# Altium schematic sheet powerSupply.SchDoc
size A4
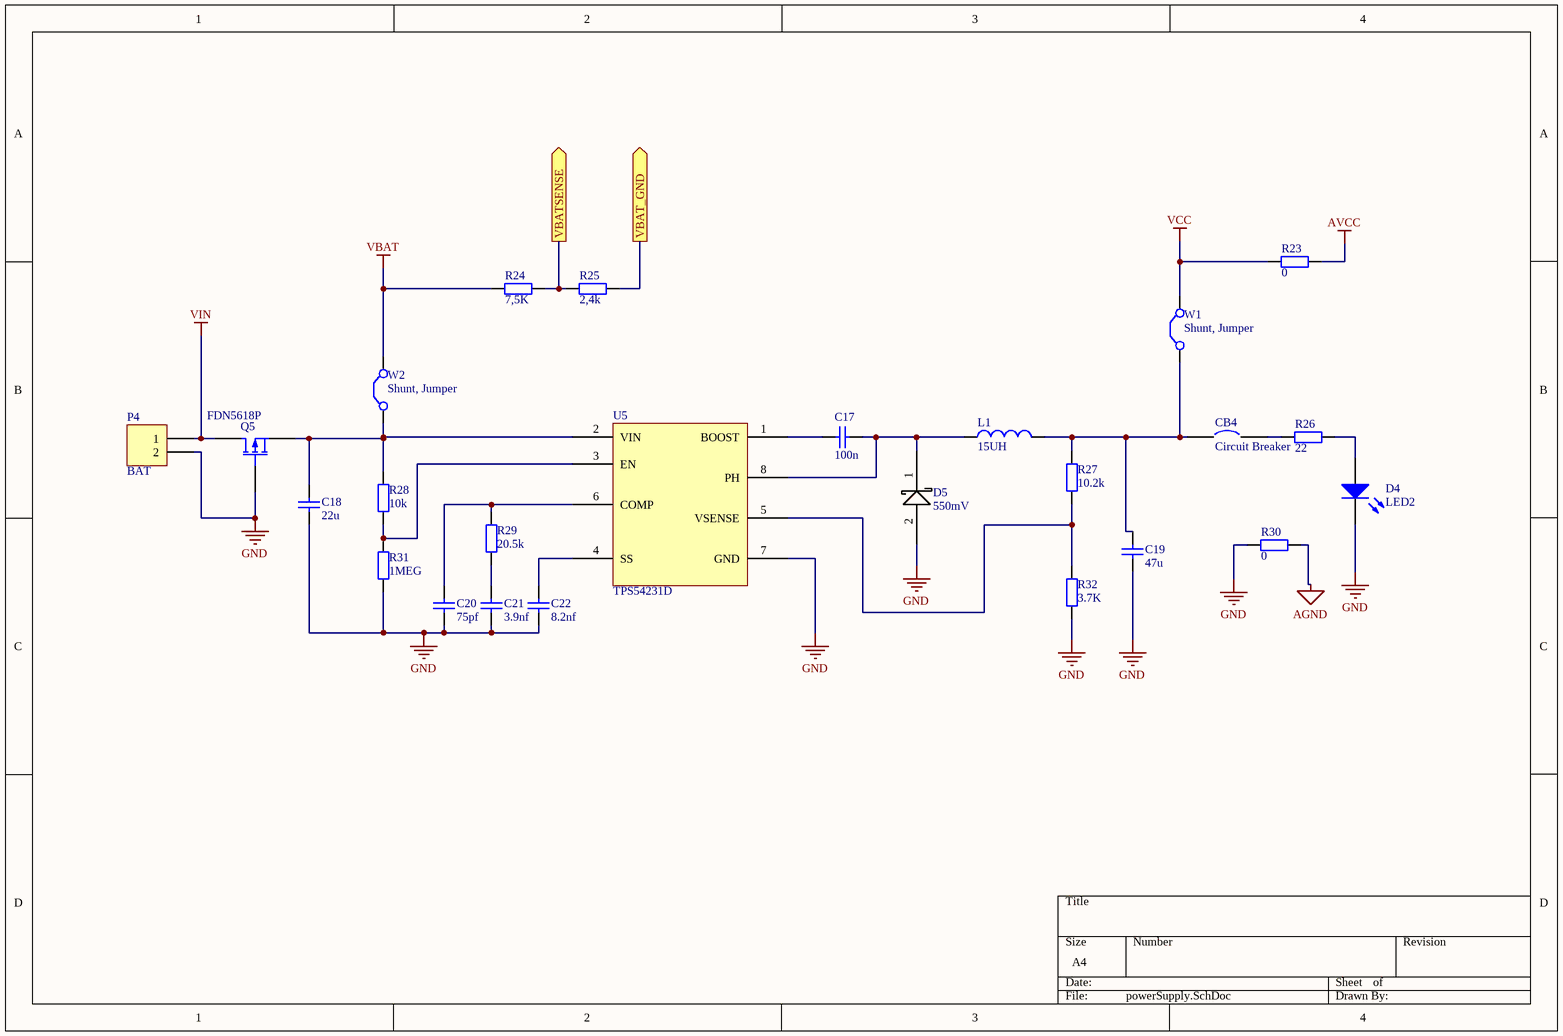
[diagram p0: powerSupply.SchDoc]

## Parts
C17  100n  [CAP 0603/1608]
C18  22u  [CAP 0603/1608]
C19  47u  [CAP 1210/3225 - 2.5MM]
C20  75pf  [CAP 0603/1608]
C21  3.9nf  [CAP 0603/1608]
C22  8.2nf  [CAP 0603/1608]
CB4  Circuit Breaker  [JUMPER PAD]
D4  LED2  [LED 0603/1608 BLUE]
D5  550mV  [microSMA]
L1  15UH  [SRN6045-3R3Y]
P4  BAT  [HDR1X2]
Q5  FDN5618P  [SOT-23_M]
R23  0  [RES 0603/1608]
R24  7,5K  [RES 0603/1608]
R25  2,4k  [RES 0603/1608]
R26  22  [RES 0603/1608]
R27  10.2k  [RES 0603/1608]
R28  10k  [RES 0603/1608]
R29  20.5k  [RES 0603/1608]
R30  0  [RES 0603/1608]
R31  1MEG  [RES 0603/1608]
R32  3.7K  [RES 0603/1608]
U5  TPS54231D  [SOIC8]
W1  Shunt, Jumper  [HDR1X2]
W2  Shunt, Jumper  [HDR1X2]

## Ports
VBAT_GND (out), VBATSENSE (out)

## Nets
AGND: R30.2
AVCC: R23.2
GND: C18.2 C19.2 C20.2 C21.2 C22.2 D4.2(K) D5.2 P4.2 Q5.2(G) R30.1 R31.1 R32.1 U5.7(GND)
VBAT: R24.2 W2.2(C2)
VCC: R23.1 W1.2(C2)
VIN: P4.1 Q5.1(D)
VBAT_GND: R25.1 ; port VBAT_GND
VBATSENSE: R24.1 R25.2 ; port VBATSENSE
NetC17_1: C17.1 U5.1(BOOST)
NetC17_2: C17.2 D5.1 L1.1 U5.8(PH)
NetC18_1: C18.1 Q5.3(S) R28.2 U5.2(VIN) W2.1(C1)
NetC19_1: C19.1 CB4.1 L1.2 R27.2 W1.1(C1)
NetC20_1: C20.1 R29.2 U5.6(COMP)
NetC21_1: C21.1 R29.1
NetC22_1: C22.1 U5.4(SS)
NetCB4_2: CB4.2 R26.1
NetD4_1: D4.1(A) R26.2
NetR27_1: R27.1 R32.2 U5.5(VSENSE)
NetR28_1: R28.1 R31.2 U5.3(EN)

## Library data of the parts
C17 = Cap: AVX  08053C104KAT2A  Condensateur céramique multicouche CMS, 0805 [2012 Metric], 0.1 µF, 25 V, ± 10%, X7R; Fournisseur: Farnell; RefFournisseur: 1740665; Fabricant: AVX; Footprint: 0603; RefFabricant: 08053C104KAT2A; Value: 100n
C18 C20-C22 = Cap: Fabricant: MURATA; Fournisseur: Farnell; Footprint: 0603
  C18: Value: 22u
  C20: Value: 75pf
  C21: Value: 3.9nf
  C22: Value: 8.2nf
C19 = Cap: Condensateur céramique multicouche CMS, 1210 [3225 Metric], 47 µF, 16 V, ± 20%, X5R, Série GRM; Fabricant: KEMET; Fournisseur: Farnell; RefFournisseur: 1572639; RefFabricant: C1206C476M8PACTU; Footprint: 1210; Value: 47u
D4 = LED2: LED, Bleu, CMS, 0.8mm x 1.6mm, 5 mA, 2.9 V, 470 nm; Fournisseur: Farnell; Fabrican: PANASONIC ELECTRONIC COMPONENTS; RefFabricant: LNJ926W8CRA; RefFournisseur: 1908050; Footprint: 0603
D5 = schottky: TAIWAN SEMICONDUCTOR  SS14M  Redresseur Schottky, 40 V, 1 A, Une, MicroSMA, 2 Broche(s), 550 mV; refFournisseur: 1863139; Fournisseur: farnell; refFabricant: SS14M; Fabricant: TAIWAN SEMICONDUCTOR; value: 550mV
L1 = Inductor: BOURNS  SRN6045-150M  Inductance de puissance CMS, 15 µH, 1.9 A, 2.3 A, Blindé, 0.0958 ohm; Fournisseur: Farnell; RefFournisseur: 2061653; fabricant: BOURNS; RefFabricant: SRN6045-150M; value: 15UH
P4 = Header 2: Header, 2-Pin; LatestRevisionDate: 17-Jul-2002; LatestRevisionNote: Re-released for DXP Platform.; Publisher: Altium Limited
Q5 = MOSFET-P: Transistor MOSFET, Canal P, -1.25 A, -60 V, 170 mohm, -10 V, 20 V; Fournisseur: Farnell; RefFournisseur: 9846344; Fabricant: FAIRCHILD SEMICONDUCTOR; RefFabricant: FDN5618P; Footprint: SuperSOT-3
R23 R30 = Res2: MULTICOMP  MC0805S8F0000T5E  Résistance à puce CMS, Couche épaisse, 0 ohm, 150 V, 0805 [2012 Metric], 125 mW, ± 1%, Série MC; Fournisseur: Farnell; RefFournisseur: 2309112; Value: 0; Fabricant: MULTICOMP; refFabricant: MC0805S8F0000T5E; Footprint: 0603
R24 = Res2: PANASONIC ELECTRONIC COMPONENTS  ERJ6GEYJ752V  Résistance à puce CMS, Couche épaisse, 7.5 kohm, 150 V, 0805 [2012 Metric], 125 mW, ± 5%; RefFournisseur: 2323866; Fournisseur: Farnell; RefFabricant: ERJ6GEYJ752V; Fabricant: PANASONIC ELECTRONIC COMPONENTS; Value: 7,5K; Footprint: 0603
R25 = Res2: YAGEO (PHYCOMP)  RC0805FR-0710KL  Résistance à puce CMS, Couche épaisse, 10 kohm, 150 V, 0805 [2012 Metric], 125 mW, ± 1%, Série RC; RefFabricant: ERJ6GEYJ242V; RefFournisseur: 2323829; Fabricant: PANASONIC ELECTRONIC COMPONENTS; Fournisseur: Farnell; Value: 2,4k; Footprint: 0603
R26 R28 R29 R31 = Res2: Fournisseur: Farnell; Fabricant: YAGEO (PHYCOMP); Footprint: 0603
  R26: Value: 22
  R28: Value: 10k
  R29: Value: 20.5k
  R31: Value: 1MEG
R27 = Res2: Fournisseur: Farnell; Value: 10.2k; Footprint: 0603
R32 = Res2: Value: 3.7K
U5 = TPS54231D: TEXAS INSTRUMENTS  TPS54231D  Régulateur DC/DC à découpage Buck (Step Down), Ajustable, 3.5V-28Vin, 800mV-25Vout, 2Aout, SOIC-8; Fournisseur: farnell; refFournisseur: 1755637; Fabricant: Texas Instrument; refFabricant: TPS54231D
W1 W2 = Jumper: Jumper Socket, Pin Headers, 2 Voies, 1.27 mm; Fabricant: SAMTEC; Fournisseur: Farnell; RefFabricant: SNT-100-BK-T-H; RefFournisseur: 1803187; Footprint: Pin Headers 2.54 mm